# Altium project Tesis_C_elegans.PrjPcb
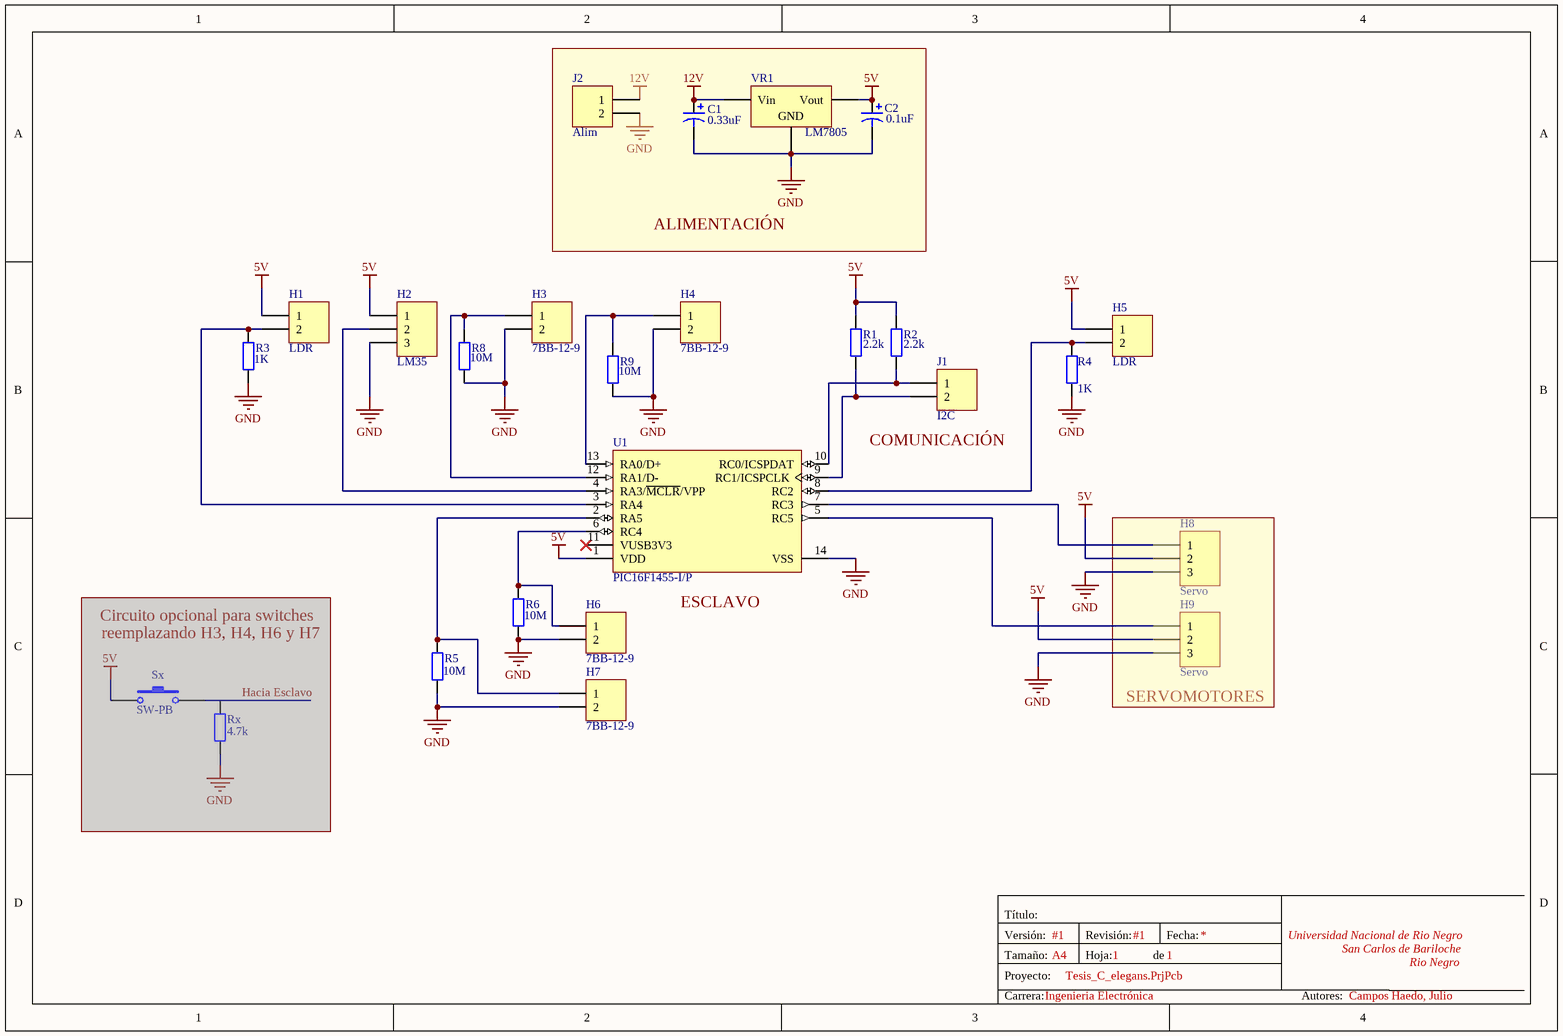
[diagram p0: Tesis-C_elegans.SchDoc]
1 sheet, 25 parts. Net scope: global (net labels, ports and power ports of the same name join across sheets).
Board file: Tesis-C_elegans.PcbDoc

## Sheet Tesis-C_elegans.SchDoc
size A4

### Parts
C1  value 0.33uF  [ceramic capacitor]
C2  value 0.1uF  [ceramic capacitor]
H1  LDR  [HDR1X2-HEADER]
H2  LM35  [HDR1X3-header]
H3  7BB-12-9  [HDR1X2-HEADER]
H4  7BB-12-9  [HDR1X2-HEADER]
H5  LDR  [HDR1X2-HEADER]
H6  7BB-12-9  [HDR1X2-HEADER]
H7  7BB-12-9  [HDR1X2-HEADER]
H8  Servo  [HDR1X3-header]
H9  Servo  [HDR1X3-header]
J1  I2C  [HDR1X2-3d - duplicate]
J2  Alim  [HDR1X2-3d - duplicate]
R1  value 2.2k  [AXIAL-0.4 -2.2K]
R2  value 2.2k  [AXIAL-0.4-10M-Folded]
R3  value 1K  [AXIAL-0.4-10M-Folded]
R4  value 1K  [AXIAL-0.4 -1K]
R5  value 10M  [AXIAL-0.4-10M-Folded]
R6  value 10M  [AXIAL-0.4-10M-Folded]
R8  value 10M  [AXIAL-0.4-10M-Folded]
R9  value 10M  [AXIAL-0.4-10M-Folded]
Rx  value 4.7k  [AXIAL-0.4-10M-Folded]  (masked out: inside a compile mask, not in the netlist)
Sx  SW-PB  [SPST-2]  (masked out: inside a compile mask, not in the netlist)
U1  PIC16F1455-I/P  [DIP-14]
VR1  LM7805  [LM7805]

### Blocks framed on the sheet
ALIMENTACIÓN: C1 C2 J2 VR1
SERVOMOTORES: H8 H9

### Nets
5V: C2.1 H1.1 H2.1 H5.1 H8.2 H9.2 R1.2 R2.2 U1.1(VDD) VR1.3(Vout)
12V: C1.1 J2.1 VR1.1(Vin)
GND: C1.2 C2.2 H2.3 H3.2 H4.2 H6.2 H7.2 H8.3 H9.3 J2.2 R3.1 R4.1 R5.2 R6.1 R8.1 R9.1 U1.14(VSS) VR1.2(GND)
NetH1_2: H1.2 R3.2 U1.3(RA4)
NetH2_2: H2.2 U1.4(RA3/~{MCLR}/VPP)
NetH3_1: H3.1 R8.2 U1.12(RA1/D-)
NetH4_1: H4.1 R9.2 U1.13(RA0/D+)
NetH5_2: H5.2 R4.2 U1.8(RC2)
NetH6_1: H6.1 R6.2 U1.6(RC4)
NetH7_1: H7.1 R5.1 U1.2(RA5)
NetH8_1: H8.1 U1.7(RC3)
NetH9_1: H9.1 U1.5(RC5)
NetJ1_1: J1.1 R2.1 U1.10(RC0/ICSPDAT)
NetJ1_2: J1.2 R1.1 U1.9(RC1/ICSPCLK)

Not connected (* = marked no-connect by the designer): U1 11(VUSB3V3)*

### Notes on the sheet
- (near J1) COMUNICACIÓN
- Circuito opcional para switches
- reemplazando H3, H4, H6 y H7
- (near U1) ESCLAVO
- Título:
- Proyecto:
- Tamaño:
- Versión:
- A4
- #1
- Hoja:
- Revisión:
- 1
- de
- Fecha:
- Universidad Nacional de Rio Negro
- San Carlos de Bariloche
- Rio Negro
- Carrera:
- Ingenieria Electrónica
- Autores:
- Campos Haedo, Julio

### Library data of the parts
C1 C2 = Cap Pol1: Polarized Capacitor (Radial); Published: 8-Jun-2000; LatestRevisionDate: 17-Jul-2002; LatestRevisionNote: Re-released for DXP Platform.; PackageReference: RB7.6-15; Publisher: Altium Limited; PackageDescription: Polarized Capacitor (Radial); 2 Leads
H1 H3-H7 J1 J2 = Header 2: Header, 2-Pin; LatestRevisionDate: 17-Jul-2002; LatestRevisionNote: Re-released for DXP Platform.; Publisher: Altium Limited
H2 H8 H9 = Header 3: Header, 3-Pin; LatestRevisionDate: 17-Jul-2002; LatestRevisionNote: Re-released for DXP Platform.; Publisher: Altium Limited
R1-R6 R8 R9 Rx = Res2: Resistor; Published: 8-Jun-2000; LatestRevisionDate: 17-Jul-2002; LatestRevisionNote: Re-released for DXP Platform.; PackageReference: AXIAL-0.4; Publisher: Altium Limited; PackageDescription: Axial Device, Thru-Hole; 2 Leads; 0.4 in Pin Spacing
Sx = SW-PB: Switch; Published: 24-Mar-1999; LatestRevisionDate: 17-Jul-2002; LatestRevisionNote: Re-released for DXP Platform.; PackageReference: SPST-2; Publisher: Altium Limited; PackageDescription: Switch; 2 Leads
U1 = PIC16F1455-I/P: 8-Bit Flash USB Microcontroller with XLP Technology, 48 MHz, 11 I/O, -40 to 85 degC, 14-pin PDIP (P14), Tube; Manufacturer: Microchip; # of A/D Channels: 5; Digital Communication: 1 -A/E/USART, 1 -MSSP(SPI/I2C); I/O Pins: 11; Max. CPU Speed MHz: 48; Operation Voltage Range: 2.3V - 5.5V; Program Memory KBytes: 14; Program Memory KWords: 8; RAM: 1024; Timers: 2 - 8-bit, 1 - 16-bit, 0 - 32-bit; DatasheetVersion: Rev. A; PackageVersion: C04-005B, 12/2012; PackageReference: PDIP-P14; PackageDescription: 14-Lead Plastic Dual In-Line, 6.6 x 19.18 mm Body, 2.54 mm Pitch; Supplier 1: Digi-Key; Supplier Part Number 1: PIC16F1455-I/P-ND; Supplier 2: Farnell; Supplier Part Number 2: 2305813; Supplier 3: Newark; Supplier Part Number 3: 83T7199; Supplier 4: Mouser; Supplier Part Number 4: 579-PIC16F1455-I/P; Memory Type: Flash; Packing: TUBE; RoHS: TRUE; Mounting Technology: Through Hole; PartNumber: PIC16F1455-I/P; ComponentLink1Description: Datasheet; ComponentLink1URL: http://ww1.microchip.com/downloads/en/DeviceDoc/41639A.pdf; ComponentLink2Description: Package Specification; ComponentLink2URL: http://www.microchip.com/stellent/groups/techpub_sg/documents/packagingspec/en012702.pdf; ComponentLink3Description: URL Link1; ComponentLink3URL: Product URL:http://www.microchip.com/datasheet/PIC16F1455
VR1 = Volt Reg: Published: 24-Mar-1999; LatestRevisionDate: 29-May-2009; LatestRevisionNote: IPC-7351 Footprint Added.; PackageReference: D2PAK; Publisher: Altium Limited; PackageDescription: 3-Pin Transistor Outline Package 2.54 mm Pitch, 15.1 mm Lead Span